# Altium schematic sheet 搅拌杯原理图.schdoc
size 430 x 290 mm
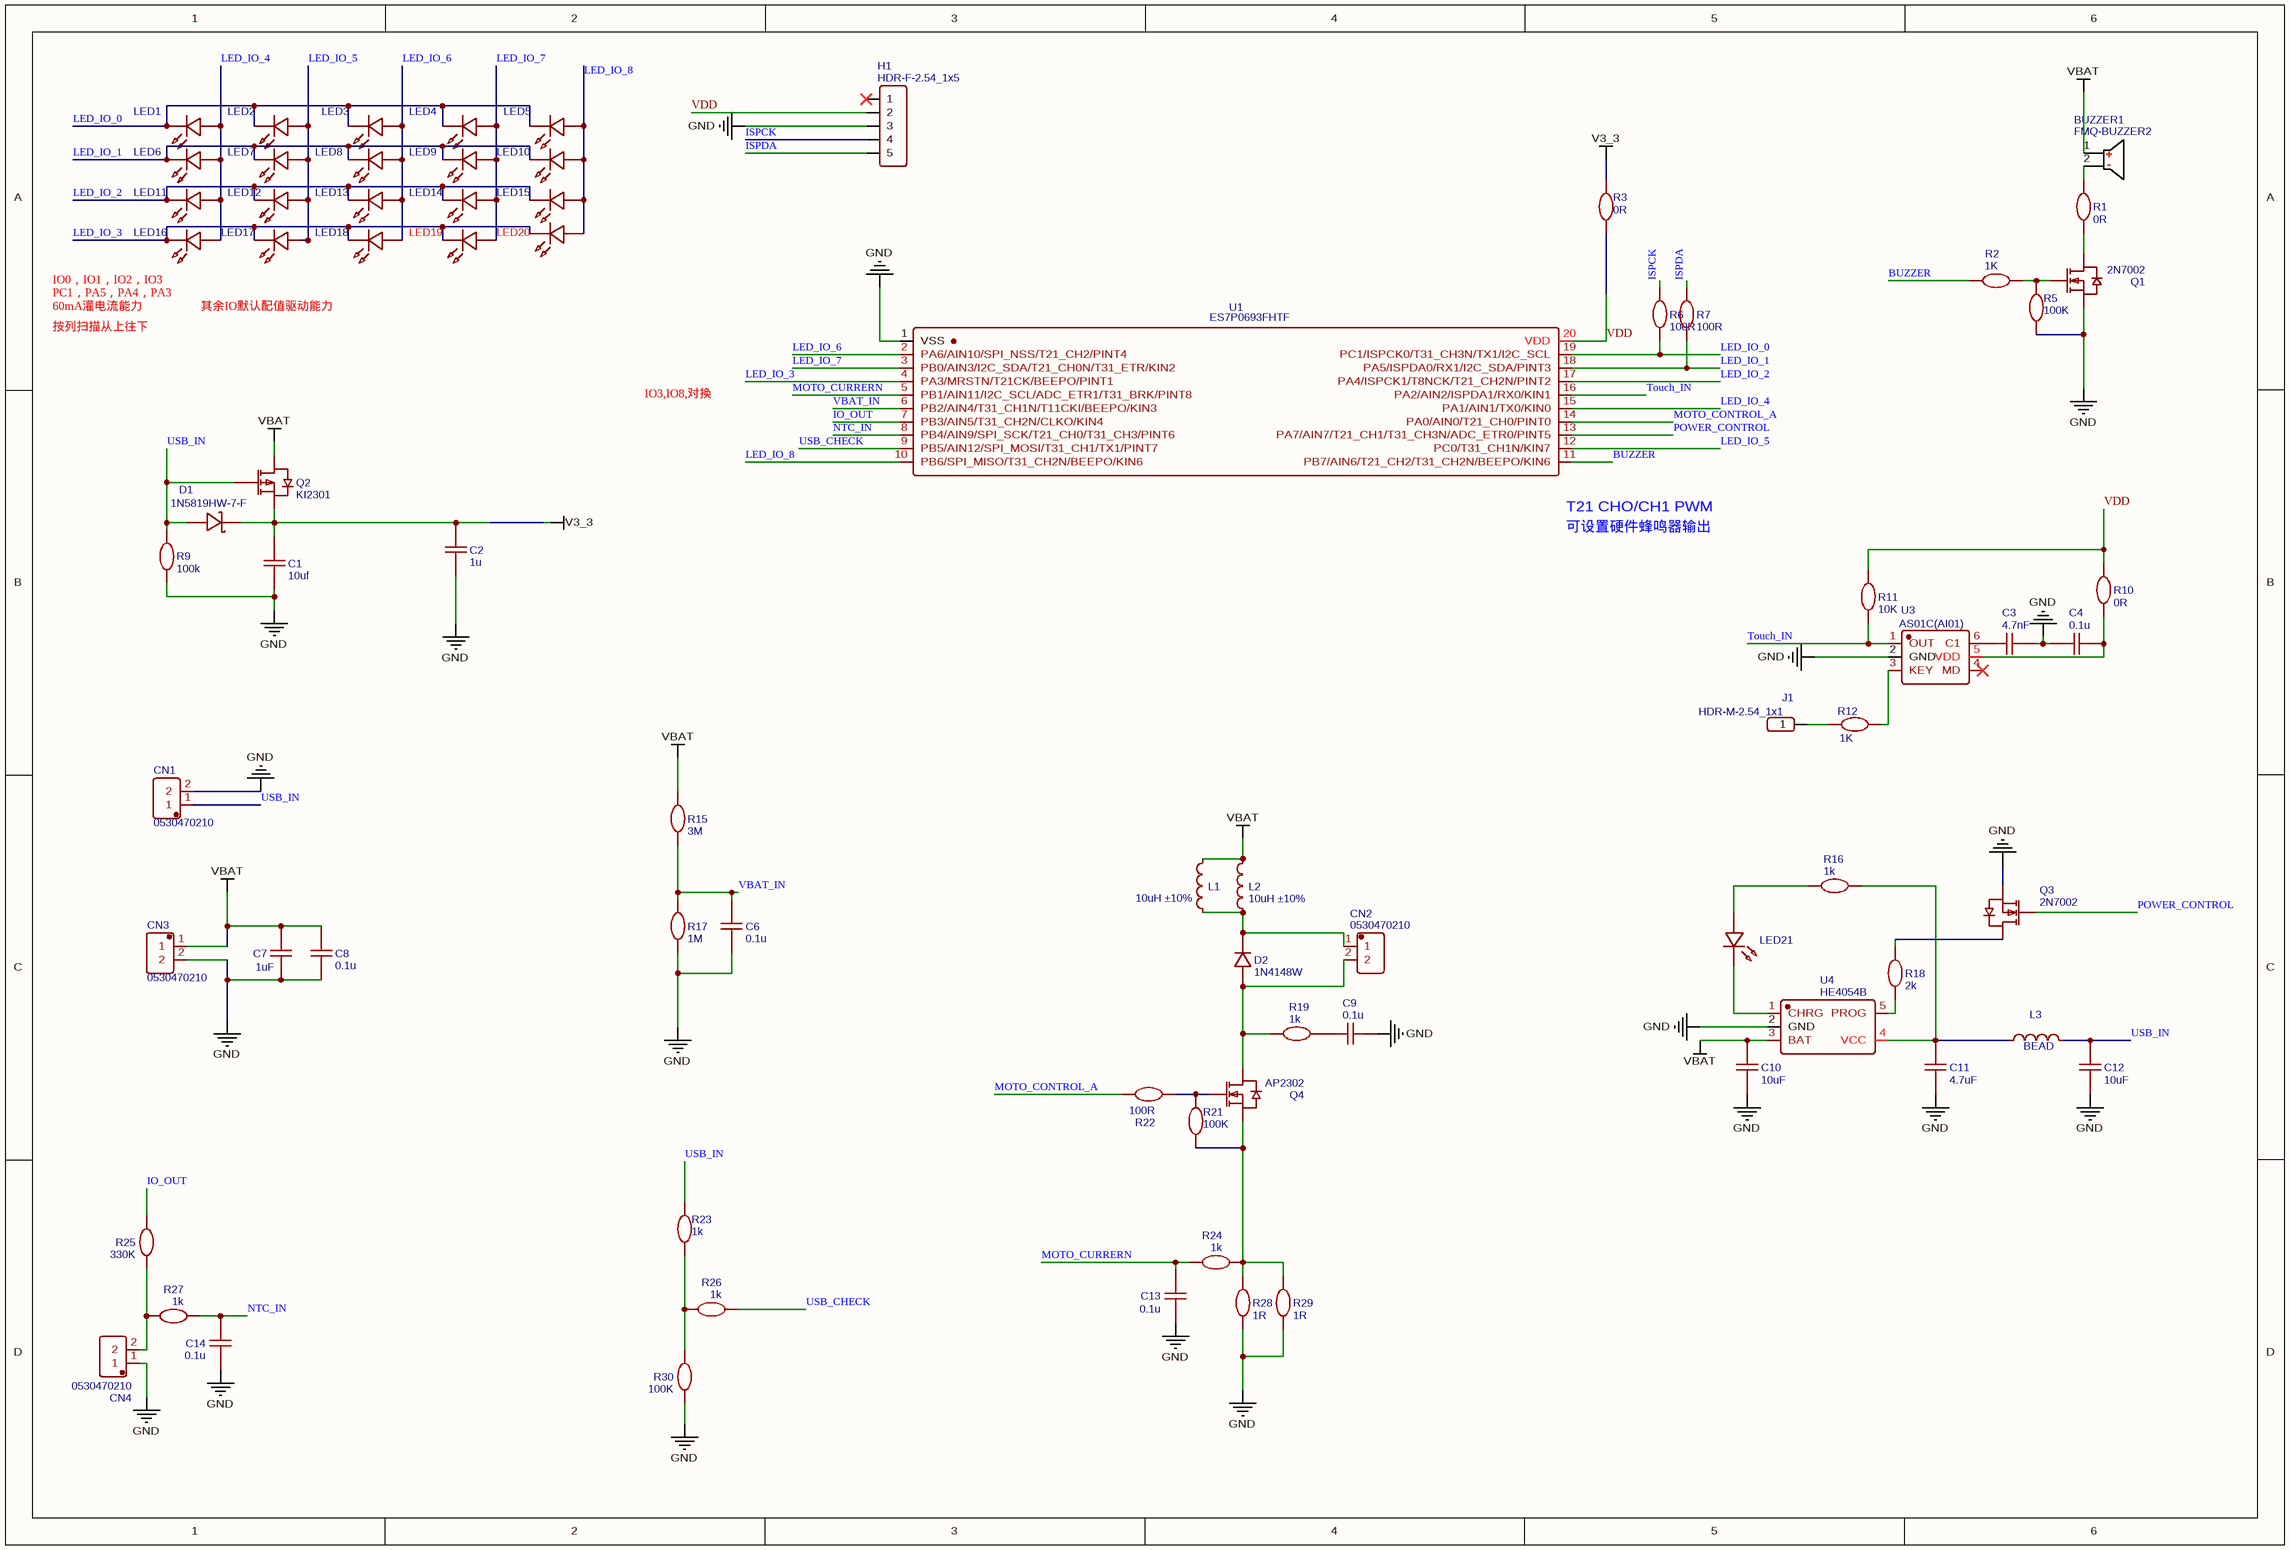
[diagram p0: 搅拌杯原理图.schdoc]

## Parts
BUZZER1  FMQ-BUZZER2  [BUZ-TH_BD12.0-P7.60-D0.6-FD]
C1  10uf  [C0603]
C2  1u  [C0603]
C3  4.7nF  [C0603]
C4  0.1u  [C0603]
C6  0.1u  [C0603]
C7  1uF  [C0603]
C8  0.1u  [C0603]
C9  0.1u  [C0603]
C10  10uF  [C0603]
C11  4.7uF  [C0603]
C12  10uF  [C0603]
C13  0.1u  [C0603]
C14  0.1u  [C0603]
CN1  0530470210  [CONN-TH_0530470210]
CN2  0530470210  [CONN-TH_0530470210]
CN3  0530470210  [CONN-TH_0530470210]
CN4  0530470210  [CONN-TH_0530470210]
D1  1N5819HW-7-F  [SOD-123_L2.8-W1.8-LS3.7-FD]
D2  1N4148W  [SOD-123FL_L2.6-W1.6-LS3.4-RD]
H1  HDR-F-2.54_1x5  [1.27mm_5PIN]
J1  HDR-M-2.54_1x1  [HDR-M-2.54_1X1]
L1  10uH ±10%  [L0603]
L2  10uH ±10%  [L0603]
L3  BEAD  [L0603]
LED1  LED-0603_W  [LED0603-FD_WHITE]  (value not drawn)
LED2  LED-0603_W  [LED0603-FD_WHITE]  (value not drawn)
LED3  LED-0603_W  [LED0603-FD_WHITE]  (value not drawn)
LED4  LED-0603_W  [LED0603-FD_WHITE]  (value not drawn)
LED5  LED-0603_W  [LED0603-FD_WHITE]  (value not drawn)
LED6  LED-0603_W  [LED0603-FD_WHITE]  (value not drawn)
LED7  LED-0603_W  [LED0603-FD_WHITE]  (value not drawn)
LED8  LED-0603_W  [LED0603-FD_WHITE]  (value not drawn)
LED9  LED-0603_W  [LED0603-FD_WHITE]  (value not drawn)
LED10  LED-0603_W  [LED0603-FD_WHITE]  (value not drawn)
LED11  LED-0603_W  [LED0603-FD_WHITE]  (value not drawn)
LED12  LED-0603_W  [LED0603-FD_WHITE]  (value not drawn)
LED13  LED-0603_W  [LED0603-FD_WHITE]  (value not drawn)
LED14  LED-0603_W  [LED0603-FD_WHITE]  (value not drawn)
LED15  LED-0603_W  [LED0603-FD_WHITE]  (value not drawn)
LED16  LED-0603_W  [LED0603-FD_WHITE]  (value not drawn)
LED17  LED-0603_W  [LED0603-FD_WHITE]  (value not drawn)
LED18  LED-0603_W  [LED0603-FD_WHITE]  (value not drawn)
LED19  LED-0603_W  [LED0603-FD_WHITE]  (value not drawn)
LED20  LED-0603_W  [LED0603-FD_WHITE]  (value not drawn)
LED21  LED-0603_W  [LED0603-FD_WHITE]  (value not drawn)
Q1  2N7002  [SOT-23_L2.9-W1.3-P0.95-LS2.4-BR]
Q2  KI2301  [SOT-23-3_L2.9-W1.3-P1.90-LS2.4-BR]
Q3  2N7002  [SOT-23_L2.9-W1.3-P0.95-LS2.4-BR]
Q4  AP2302  [SOT-23_L2.9-W1.3-P0.95-LS2.4-BR]
R1  0R  [R0603]
R2  1K  [R0603]
R3  0R  [R1206]
R5  100K  [R0603]
R6  100R  [R0603]
R7  100R  [R0603]
R9  100k  [C0603]
R10  0R  [R0603]
R11  10K  [R0603]
R12  1K  [R0603]
R15  3M  [R0603]
R16  1k  [R0603]
R17  1M  [R0603]
R18  2k  [R0603]
R19  1k  [R0603]
R21  100K  [R0603]
R22  100R  [R0603]
R23  1k  [R0603]
R24  1k  [R0603]
R25  330K  [R0603]
R26  1k  [R0603]
R27  1k  [R0603]
R28  1R  [R1206]
R29  1R  [R1206]
R30  100K  [R0603]
U1  ES7P0693FHTF  [TSOP20]  (value not drawn)
U3  AS01C(AI01)  [SOT-23-6_L2.9-W1.6-P0.95-LS2.8-BL]
U4  HE4054B  [SOT-23-5_L3.0-W1.7-P0.95-LS2.8-BR]

## Nets
GND: C1.1 C2.1 C3.2 C4.1 C6.1 C7.2 C8.2 C9.1 C10.1 C11.1 C12.1 C13.1 C14.2 CN1.2 CN3.2 CN4.1 H1.3 Q1.2(S) Q3.2(S) R5.2 R9.1 R17.1 R28.1 R29.1 R30.2 U1.1(VSS) U3.2(GND) U4.2(GND)
V3_3: C1.2 C2.2 D1.2(K) Q2.2(S) R3.2
VBAT: BUZZER1.1 C7.1 C8.1 C10.2 CN3.1 L1.2 L2.2 Q2.3(D) R15.2 U4.3(BAT)
BUZZER: R2.2 U1.11(PB7/AIN6/T21_CH2/T31_CH2N/BEEPO/KIN6)
IO_OUT: R25.1 U1.7(PB3/AIN5/T31_CH2N/CLKO/KIN4)
ISPCK: H1.4 R6.1
ISPDA: H1.5 R7.1
LED_IO_0: LED1.2 LED2.2 LED3.2 LED4.2 LED5.2 R6.2 U1.19(PC1/ISPCK0/T31_CH3N/TX1/I2C_SCL)
LED_IO_1: LED6.2 LED7.2 LED8.2 LED9.2 LED10.2 R7.2 U1.18(PA5/ISPDA0/RX1/I2C_SDA/PINT3)
LED_IO_2: LED11.2 LED12.2 LED13.2 LED14.2 LED15.2 U1.17(PA4/ISPCK1/T8NCK/T21_CH2N/PINT2)
LED_IO_3: LED16.2 LED17.2 LED18.2 LED19.2 LED20.2 U1.4(PA3/MRSTN/T21CK/BEEPO/PINT1)
LED_IO_4: LED1.1 LED6.1 LED11.1 LED16.1 U1.15(PA1/AIN1/TX0/KIN0)
LED_IO_5: LED2.1 LED7.1 LED12.1 LED17.1 U1.12(PC0/T31_CH1N/KIN7)
LED_IO_6: LED3.1 LED8.1 LED13.1 LED18.1 U1.2(PA6/AIN10/SPI_NSS/T21_CH2/PINT4)
LED_IO_7: LED4.1 LED9.1 LED14.1 LED19.1 U1.3(PB0/AIN3/I2C_SDA/T21_CH0N/T31_ETR/KIN2)
LED_IO_8: LED5.1 LED10.1 LED15.1 LED20.1 U1.10(PB6/SPI_MISO/T31_CH2N/BEEPO/KIN6)
MOTO_CONTROL_A: R22.1 U1.14(PA0/AIN0/T21_CH0/PINT0)
MOTO_CURRERN: C13.2 R24.2 U1.5(PB1/AIN11/I2C_SCL/ADC_ETR1/T31_BRK/PINT8)
NTC_IN: C14.1 R27.2 U1.8(PB4/AIN9/SPI_SCK/T21_CH0/T31_CH3/PINT6)
POWER_CONTROL: Q3.1(G) U1.13(PA7/AIN7/T21_CH1/T31_CH3N/ADC_ETR0/PINT5)
Touch_IN: R11.1 U1.16(PA2/AIN2/ISPDA1/RX0/KIN1) U3.1(OUT)
USB_CHECK: R26.2 U1.9(PB5/AIN12/SPI_MOSI/T31_CH1/TX1/PINT7)
USB_IN: C12.2 CN1.1 D1.1(A) L3.2 Q2.1(G) R9.2 R23.2
VBAT_IN: C6.2 R15.1 R17.2 U1.6(PB2/AIN4/T31_CH1N/T11CKI/BEEPO/KIN3)
VDD: H1.2 R3.1 R10.2 R11.2 U1.20(VDD)
NetBUZZER1_2: BUZZER1.2 R1.1
NetC3_1: C3.1 U3.6(C1)
NetC4_2: C4.2 R10.1 U3.5(VDD)
NetC9_2: C9.2 R19.1
NetC11_2: C11.2 L3.1 R16.1 U4.4(VCC)
NetCN2_1: CN2.1 D2.1 L1.1 L2.1
NetCN2_2: CN2.2 D2.2 Q4.3(D) R19.2
NetCN4_2: CN4.2 R25.2 R27.1
NetJ1_1: J1.1 R12.2
NetLED21_1: LED21.1 R16.2
NetLED21_2: LED21.2 U4.1(CHRG)
NetQ1_1: Q1.1(G) R2.1 R5.1
NetQ1_3: Q1.3(D) R1.2
NetQ3_3: Q3.3(D) R18.2
NetQ4_1: Q4.1(G) R21.1 R22.2
NetQ4_2: Q4.2(S) R21.2 R24.1 R28.2 R29.2
NetR12_1: R12.1 U3.3(KEY)
NetR18_1: R18.1 U4.5(PROG)
NetR23_1: R23.1 R26.1 R30.1

Not connected (* = marked no-connect by the designer): H1 1*; U3 4(MD)*

## Notes on the sheet
- IO0，IO1，IO2，IO3
- PC1，PA5，PA4，PA3
- 60mA灌电流能力
- 按列扫描从上往下
- 其余IO默认配值驱动能力
- IO3,IO8,对换
- 可设置硬件蜂鸣器输出
- (near U1) T21 CHO/CH1 PWM

## Library data of the parts
BUZZER1 = FMQ-BUZZER2: Contributor: LCSC; BOM_Supplier: LCSC; BOM_Supplier Part: C9900006103; BOM_Manufacturer Part: FMQ-BUZZER2; BOM_JLCPCB Part Class: Extended Part; spicePre: B; spiceSymbolName: FMQ-BUZZER2
C1 = 10uf: BOM_Manufacturer Part: JMK105CBJ106MV-F; BOM_Manufacturer: TAIYO YUDEN; nameAlias: Value(F); Contributor: LCEDA_Lib; BOM_Supplier Part: C87148; BOM_Supplier: LCSC; spicePre: C; spiceSymbolName: C_0805_US
C2 = 1u: nameAlias: Value(F); Contributor: LCEDA_Lib; spicePre: C; spiceSymbolName: C_0805_US
C3 = 4.7nF: nameAlias: Value(F); Contributor: LCEDA_Lib; spicePre: C; spiceSymbolName: C_0805_US
C4 C6 C8 C9 C13 C14 = 0.1u: nameAlias: Value(F); Contributor: LCEDA_Lib; spicePre: C
  C4: spiceSymbolName: C_0805_US
  C6 C8 C9 C13 C14: spiceSymbolName: C_0603_US
C7 = 1uF: nameAlias: Value(F); Contributor: LCEDA_Lib; spicePre: C; spiceSymbolName: C_0603_US
C10 C12 = 10uF: nameAlias: Value(F); Contributor: LCEDA_Lib; spicePre: C; spiceSymbolName: C_0805_US
C11 = 4.7uF: nameAlias: Value(F); Contributor: LCEDA_Lib; spicePre: C; spiceSymbolName: C_0805_US
CN1-CN4 = 0530470210: BOM_Manufacturer: MOLEX; Contributor: LCSC; BOM_Supplier: LCSC; BOM_Manufacturer Part: 0530470210; BOM_Supplier Part: C114130; BOM_JLCPCB Part Class: Extended Part; spicePre: C; spiceSymbolName: 0530470210
D1 = 1N5819HW-7-F: BOM_Manufacturer: DIODES; BOM_Supplier: LCSC; BOM_Manufacturer Part: 1N5819HW-7-F; BOM_Supplier Part: C82544; BOM_JLCPCB Part Class: Extended Part; spicePre: D; spiceSymbolName: 1N5819HW-7-F
D2 = 1N4148W: BOM_Manufacturer: Tak Cheong; Contributor: LCEDA_Lib; BOM_Supplier: LCSC; BOM_Manufacturer Part: 1N4148W; BOM_Supplier Part: C129216; spicePre: D; spiceSymbolName: 1N4148W
H1 = HDR-F-2.54_1x5: Contributor: LCEDA_Lib; BOM_Supplier Part: C50950; BOM_Supplier: LCSC; spicePre: H; spiceSymbolName: HDR-F-2.54_1x5
J1 = HDR-M-2.54_1x1: Contributor: LCEDA_Lib; BOM_Supplier Part: C81276; BOM_Supplier: LCSC; spicePre: J; spiceSymbolName: HDR-M-2.54_1x1
L1-L3 = 22uH: nameAlias: Value(H); Contributor: LCEDA_Lib; spicePre: L; spiceSymbolName: L0603_US
LED1-LED21 = LED-0603_W: BOM_Manufacturer: EVERLIGHT(台湾亿光); BOM_Manufacturer Part: 17-21SURC/S530-A3/TR8; Contributor: LCEDA_Lib; BOM_Supplier Part: C72037; spicePre: L; spiceSymbolName: LED-0805_R
Q1 Q3 Q4 = 2N7002: BOM_Manufacturer: Nexperia; BOM_Manufacturer Part: 2N7002,215; BOM_Paste Type: expand; Contributor: LCEDA_Lib; BOM_Supplier: LCSC; image: //image.lceda.cn/szlcsc/C65189.jpg; BOM_Supplier Part: C65189; spicePre: Q; spiceSymbolName: 2N7002
Q2 = KI2301: BOM_Manufacturer: LGE; Contributor: LCSC; BOM_Supplier: LCSC; BOM_Supplier Part: C688914; BOM_Manufacturer Part: KI2301; BOM_JLCPCB Part Class: Extended Part; spicePre: Q; spiceSymbolName: KI2301
R1 R6 R7 R22 = 100R: nameAlias: Value(Ω); Contributor: LCEDA_Lib; spicePre: R; spiceSymbolName: R_0603_EU
R2 R5 R12 R21 = 1K: nameAlias: Value(Ω); Contributor: LCEDA_Lib; spicePre: R; spiceSymbolName: R_0603_EU
R3 R28 R29 = 1R: nameAlias: Value(Ω); Contributor: LCEDA_Lib; spicePre: R; spiceSymbolName: R_0603_EU
R9 = 100k: nameAlias: Value(Ω); Contributor: LCEDA_Lib; spicePre: R; spiceSymbolName: R_0603_EU
R10 R11 = NC: nameAlias: Value(Ω); Contributor: LCEDA_Lib; spicePre: R; spiceSymbolName: R_0603_EU
R15 = 430k: nameAlias: Value(Ω); Contributor: LCEDA_Lib; spicePre: R; spiceSymbolName: R_0603_EU
R16 R18 R19 R23 R24 R26 R27 = 1k: nameAlias: Value(Ω); Contributor: LCEDA_Lib; spicePre: R; spiceSymbolName: R_0603_EU
R17 = 430K: nameAlias: Value(Ω); Contributor: LCEDA_Lib; spicePre: R; spiceSymbolName: R_0603_EU
R25 R30 = 33K: nameAlias: Value(Ω); Contributor: LCEDA_Lib; spicePre: R; spiceSymbolName: R_0603_EU
U1 = ES7P0693FHTF: Contributor: zime_zl; spicePre: U; spiceSymbolName: ES7P0693FHTF
U3 = AS01C(AI01): BOM_Manufacturer: Sam&wing; Contributor: LCSC; BOM_Supplier: LCSC; BOM_Supplier Part: C389617; BOM_Manufacturer Part: AS01C(AI01); BOM_JLCPCB Part Class: Extended Part; spicePre: U; spiceSymbolName: AS01C(AI01)
U4 = HE4054B: BOM_Manufacturer: HEERMICR; Contributor: LCSC; BOM_Supplier: LCSC; BOM_Supplier Part: C711953; BOM_Manufacturer Part: HE4054B; BOM_JLCPCB Part Class: Extended Part; spicePre: U; spiceSymbolName: HE4054B